# EAGLE schematic Group6_12V_Splitter (EAGLE 9.6.2)
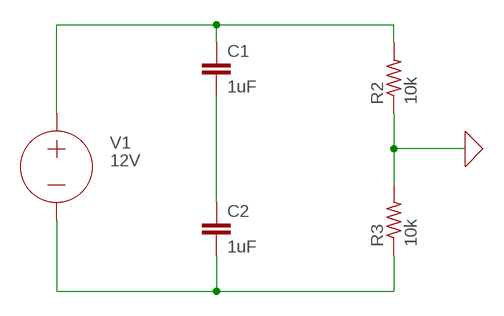
[diagram p0: schematic, sheet 1]

## Parts
C1  1uF  C2,5-3  [C2.5-3]
C2  1uF  C2,5-3  [C2.5-3]
R2  10k  R-US_0204/7  [0204/7]
R3  10k  R-US_0204/7  [0204/7]
V1  12V  VOLTAGE  (no package)

## Nets
0: R2.1 R3.2 ; supply symbol labelled GND
N$1: C1.2 C2.1
N$2: C1.1 R2.2 V1.+
N$4: C2.2 R3.1 V1.-

## Library data of the parts
C1 C2 = capacitor-wima:C: CAPACITOR naming: grid - package width
R2 R3 = rcl:R-US_: RESISTOR, American symbol; SPICEPREFIX: R
V1 = ngspice-simulation:VOLTAGE: Independent Voltage Source, either DC, AC, PULSE, SINE, PWL, EXP, or SFFM; VALUE: 0V